# Altium project ETH_on_RS485_Node_Example.PrjPcb
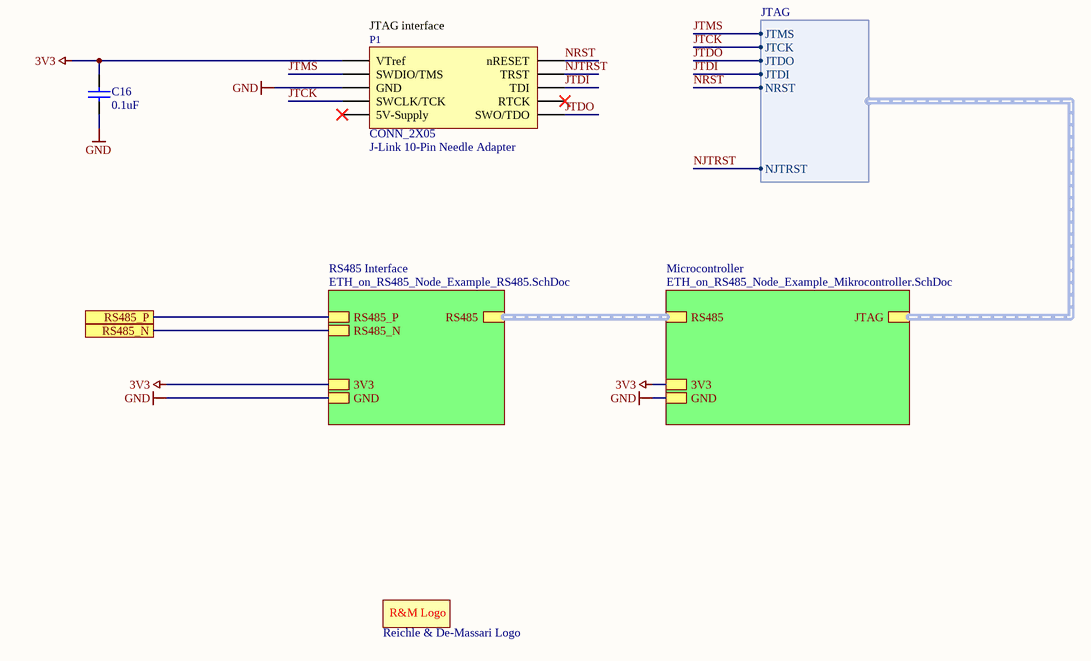
[diagram p0: ETH_on_RS485_Node_Example_TOP.SchDoc]
3 sheets, 39 parts. Net scope: strictly hierarchical (ports join the sheet entries above them; power ports are local).
Sheets:
  ETH_on_RS485_Node_Example_TOP.SchDoc
    RS485 Interface = ETH_on_RS485_Node_Example_RS485.SchDoc
    Microcontroller = ETH_on_RS485_Node_Example_Mikrocontroller.SchDoc

## Sheet ETH_on_RS485_Node_Example_TOP.SchDoc: ETH_on_RS485_Node_Example
size A3; Author: Nico Korn; CompanyName: R&M; DrawnBy: Nico Korn; Engineer: Nico Korn; Organization: Reichle & De-Massari; Address1: Binzstrasse 32; Address2: 8620 Wetzikon; Address3: Switzerland; DocumentNumber: 1; Revision: V1.0; SheetNumber: 1; SheetTotal: 7; Description1: Beschreibung; Size: A3; ShortDescription: Übersicht

### Parts
1  Reichle & De-Massari Logo  [SYMBOL_R&M]  (no BOM)
C16  0.1uF  [Ceramic Capacitor 0402 EIA]
P1  CONN_2X05  [CONN_2X05_SEGGER]  (no BOM)

### Sub-sheets
Microcontroller = ETH_on_RS485_Node_Example_Mikrocontroller.SchDoc: RS485 (harness RS485), 3V3, GND, JTAG (harness JTAG)
RS485 Interface = ETH_on_RS485_Node_Example_RS485.SchDoc: 3V3, RS485_P, RS485_N, GND, RS485 (harness RS485)

### Ports
RS485_N, RS485_P

### Harnesses
JTAG: JTMS, JTCK, JTDI, JTDO, NRST, NJTRST

### Nets
3V3: C16.2 P1.1(VTref) ; sheet RS485 Interface/3V3, sheet Microcontroller/3V3
GND: C16.1 P1.3(GND) ; sheet RS485 Interface/GND, sheet Microcontroller/GND
JTCK: P1.4(SWCLK/TCK) ; sheet Microcontroller/JTAG.JTCK
JTDI: P1.8(TDI) ; sheet Microcontroller/JTAG.JTDI
JTDO: P1.6(SWO/TDO) ; sheet Microcontroller/JTAG.JTDO
JTMS: P1.2(SWDIO/TMS) ; sheet Microcontroller/JTAG.JTMS
NJTRST: P1.9(TRST) ; sheet Microcontroller/JTAG.NJTRST
NRST: P1.10(nRESET) ; sheet Microcontroller/JTAG.NRST
RS485_1_N: port RS485_N, sheet RS485 Interface/RS485_N
RS485_1_P: port RS485_P, sheet RS485 Interface/RS485_P

Not connected (* = marked no-connect by the designer): P1 5(5V-Supply)* 7(RTCK)*

### Buses and harness runs
harness sheet Microcontroller/RS485 = sheet RS485 Interface/RS485

### Notes on the sheet
- (near P1) JTAG interface
- Title
- Size:
- Date:
- A3
- Number:
- Time:
- Revision:
- Sheet
- of
- File:
- (in symbol SYMBOL_R&M) R&M Logo

### Library data of the parts
1 = SYMBOL_R&M: Replaceable: no; Footprint/Package: 2.54mm
C16 = Cap_0.1uF_0402: SMD/SMT WCAP-CSGP 0.1uF 0402 20% 10V MLCC; Manufacturer: Wurth Electronics; Manufacturer PartNr: 885012105010; voltage: 10VDC; Dielectric Grade: X5R; Replaceable: yes; value: 0.1uF; tolerance: 20%; ComponentLink1Description: mouser; ComponentLink1URL: https://www.mouser.ch/ProductDetail/Wurth-Electronics/885012105010?qs=sGAEpiMZZMs0AnBnWHyRQEGbLOF2VP1ihL84oCjXnlO407YOHi%2fQbw%3d%3d; Footprint/Package: 0402; Supplier 1: Mouser; Supplier 2: Farnell; Supplier Part Number 1: 710-885012105010; Supplier Part Number 2: 2533928; Supplier 3: Digi-Key; Supplier Part Number 3: 732-7487-1-ND
P1 = CONN_2X05_SEGGER: J-Link 10-Pin Needle Adapter; Manufacturer: Samtec; Replaceable: no; Footprint/Package: 1.27 mm; Manufacturer PartNr: J-Link 10-Pin Needle Adapter

## Sheet ETH_on_RS485_Node_Example_RS485.SchDoc: RS485 Interface
size A3; DrawnBy: Nico Korn; Engineer: Nico Korn; Organization: Reichle & De-Massari; Address1: Binzstrasse 32; Address2: 8620 Wetzikon; Address3: Switzerland; DocumentNumber: 5; Revision: V1.0; SheetNumber: 5; SheetTotal: 7; Description1: Beschreibung; Size: A3; ShortDescription: RS485
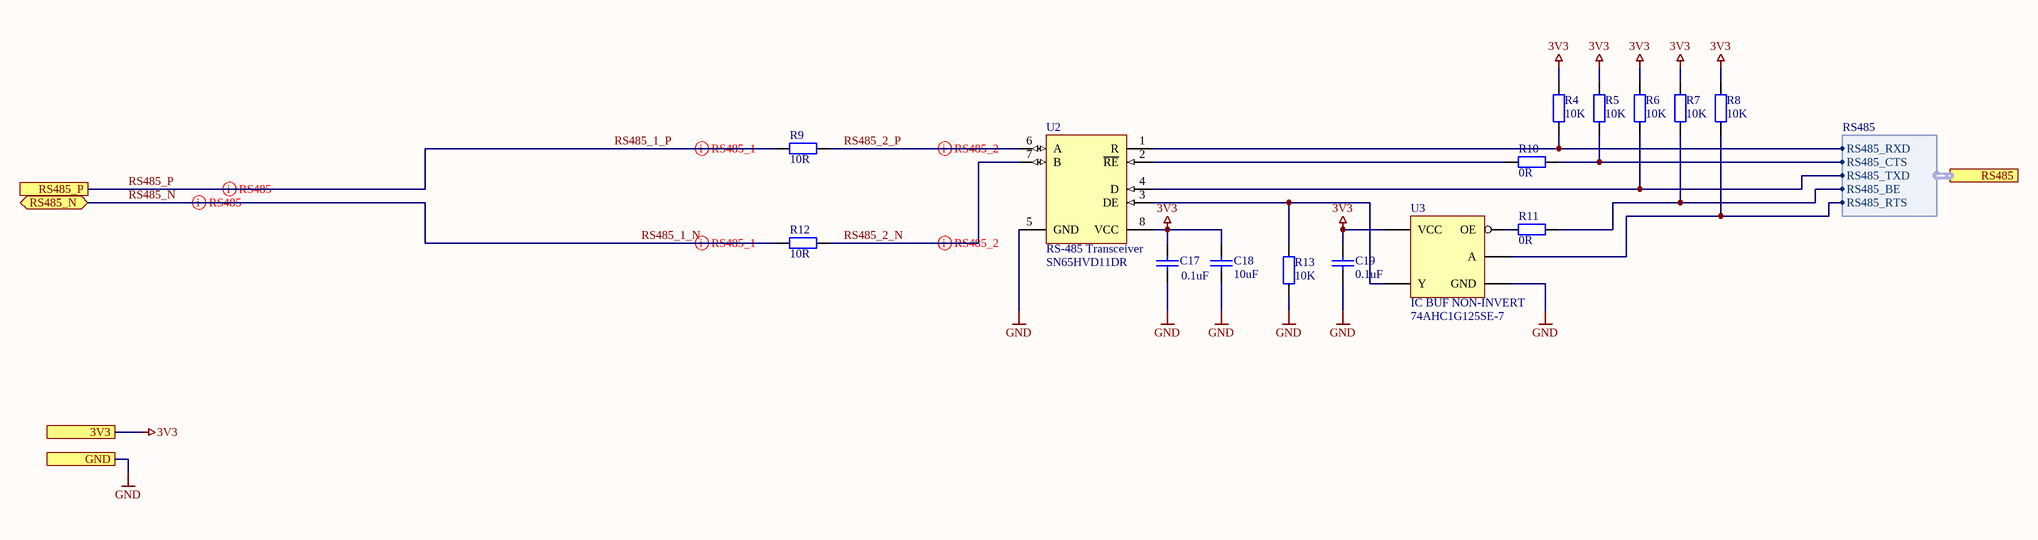
[diagram p1: ETH_on_RS485_Node_Example_RS485.SchDoc]

### Parts
C17  0.1uF  [Ceramic Capacitor 0402 EIA]
C18  10uF  [Ceramic Capacitor 0603 EIA]
C19  0.1uF  [Ceramic Capacitor 0402 EIA]
R4  10K  [Resistor 0402 EIA]
R5  10K  [Resistor 0402 EIA]
R6  10K  [Resistor 0402 EIA]
R7  10K  [Resistor 0402 EIA]
R8  10K  [Resistor 0402 EIA]
R9  10R  [Resistor 0603 EIA]
R10  0R  [Resistor 0402 EIA]
R11  0R  [Resistor 0402 EIA]
R12  10R  [Resistor 0603 EIA]
R13  10K  [Resistor 0402 EIA]
U2  RS-485 Transceiver  [TI_D (R-PDSO-G8)_8_R]
U3  IC BUF NON-INVERT  [SOT353]

### Ports
3V3, GND, RS485 (harness RS485), RS485_N (bidir), RS485_P

### Harnesses
RS485: RS485_RXD, RS485_CTS, RS485_TXD, RS485_BE, RS485_RTS

### Nets
3V3: C17.1 C18.2 C19.1 R4.2 R5.2 R6.2 R7.2 R8.2 U2.8(VCC) U3.5(VCC) ; port 3V3
GND: C17.2 C18.1 C19.2 R13.1 U2.5(GND) U3.3(GND) ; port GND
RS485_1_N: R12.1 ; port RS485_N  [also labelled RS485_N]
RS485_1_P: R9.1 ; port RS485_P  [also labelled RS485_P]
RS485_2_N: R12.2 U2.7(B)
RS485_2_P: R9.2 U2.6(A)
RS485_BE: R7.1 R11.2 ; port RS485.RS485_BE
RS485_CTS: R5.1 R10.2 ; port RS485.RS485_CTS
RS485_RTS: R8.1 U3.2(A) ; port RS485.RS485_RTS
RS485_RXD: R4.1 U2.1(R) ; port RS485.RS485_RXD
RS485_TXD: R6.1 U2.4(D) ; port RS485.RS485_TXD
NetR10_1: R10.1 U2.2(~{RE})
NetR11_1: R11.1 U3.1(OE)
NetR13_2: R13.2 U2.3(DE) U3.4(Y)

### Layout directives
differential pair: RS485_1_N, RS485_1_P, RS485_2_N, RS485_2_P

### Notes on the sheet
- Title
- Size:
- Date:
- A3
- Number:
- Time:
- Revision:
- Sheet
- of
- File:

### Library data of the parts
C17 C19 = Cap_0.1uF_0402: as C16 on sheet ETH_on_RS485_Node_Example_TOP; value: 0.1uF; tolerance: 20%; ComponentLink1Description: mouser; ComponentLink1URL: https://www.mouser.ch/ProductDetail/Wurth-Electronics/885012105010?qs=sGAEpiMZZMs0AnBnWHyRQEGbLOF2VP1ihL84oCjXnlO407YOHi%2fQbw%3d%3d; Footprint/Package: 0402; Supplier 1: Mouser; Supplier 2: Farnell; Supplier 3: Digi-Key; Supplier Part Number 1: 710-885012105010; Supplier Part Number 2: 2533928; Supplier Part Number 3: 732-7487-1-ND
C18 = Cap_10uF_0603: SMD/SMT 0603 10uF 10volts; Manufacturer: Murata; Manufacturer PartNr: GRM188D71A106MA73D; tolerance: 20%; voltage: 10VDC; Replaceable: yes; Dielectric Grade: X5R; value: 10uF; Footprint/Package: 0603
R4-R8 R13 = Res_10K_0402: SMD 10K ohm 1% 50V General Purpose; Manufacturer: Yageo; Manufacturer PartNr: RC0402FR-1010KL; power: 63mW; Replaceable: yes; value: 10K; tolerance: 1%; ComponentLink1Description: mouser; ComponentLink1URL: https://www.mouser.ch/ProductDetail/Yageo/RC0402FR-1010KL?qs=sGAEpiMZZMtlubZbdhIBIEgN9MQql2m6Sb2LnYlCICU%3d; Footprint/Package: 0402; Supplier 1: Mouser; Supplier Part Number 1: 603-RC0402FR-1010KL
R9 R12 = Res_10R_0603: SMD 0603 10ohms 1%; Manufacturer: Vishay; Manufacturer PartNr: CRCW060310R0FKEAHP; power: 250mW; Replaceable: yes; value: 10R; tolerance: 1%; Footprint/Package: 0603
R10 R11 = Res_0R_0402: 0 Ohms Resistor 0402; Manufacturer: Panasonic Electronic Components; Manufacturer PartNr: ERJ-2GE0R00X; power: 100mW; Replaceable: yes; value: 0R; tolerance: -; Footprint/Package: 0402
U2 = SN65HVD11DR: RS-485 Interface IC 3.3V Differential Transceivers; Manufacturer: Texas Instruments; Replaceable: no; Manufacturer PartNr: SN65HVD11DR; ComponentLink1Description: mouser; ComponentLink1URL: https://www.mouser.ch/ProductDetail/Texas-Instruments/SN65HVD11DR?qs=sGAEpiMZZMtk5jbcouIbS2cUqarwnJ3LOIItPoxnG4E%3d; Footprint/Package: SOIC-8; Supplier 1: Digi-Key; Supplier 2: Farnell; Supplier 3: Mouser; Supplier Part Number 1: 296-31717-6-ND; Supplier Part Number 2: 2436743; Supplier Part Number 3: 595-SN65HVD11DR
U3 = 74AHC1G125SE-7: Buffer, Non-Inverting 1 Element 1 Bit per Element 3-State Output SOT-353; Manufacturer: Diodes Incorporated; Replaceable: no; Footprint/Package: SOT353; ComponentLink1Description: mouser; ComponentLink1URL: https://www.mouser.ch/ProductDetail/Samtec/BBL-103-G-E?qs=sGAEpiMZZMs%252bGHln7q6pm5ZHNJhTjtr3eyJKd0ZImQM%3d; Supplier 2: Mouser; Supplier 1: Digi-Key; Supplier 3: Farnell; Supplier Part Number 1: SAM1104-03-ND; Supplier Part Number 2: 200-SL103G12; Supplier Part Number 3: 2019491; Manufacturer PartNr: 74AHC1G125SE-7

## Sheet ETH_on_RS485_Node_Example_Mikrocontroller.SchDoc: Microcontroller
size A3; DrawnBy: Nico Korn; Engineer: Nico Korn; Organization: Reichle & De-Massari; Address1: Binzstrasse 32; Address2: 8620 Wetzikon; Address3: Switzerland; DocumentNumber: 2; Revision: V1.0; SheetNumber: 2; SheetTotal: 7; Description1: Beschreibung; Size: A3; ShortDescription: Mikrocontroller
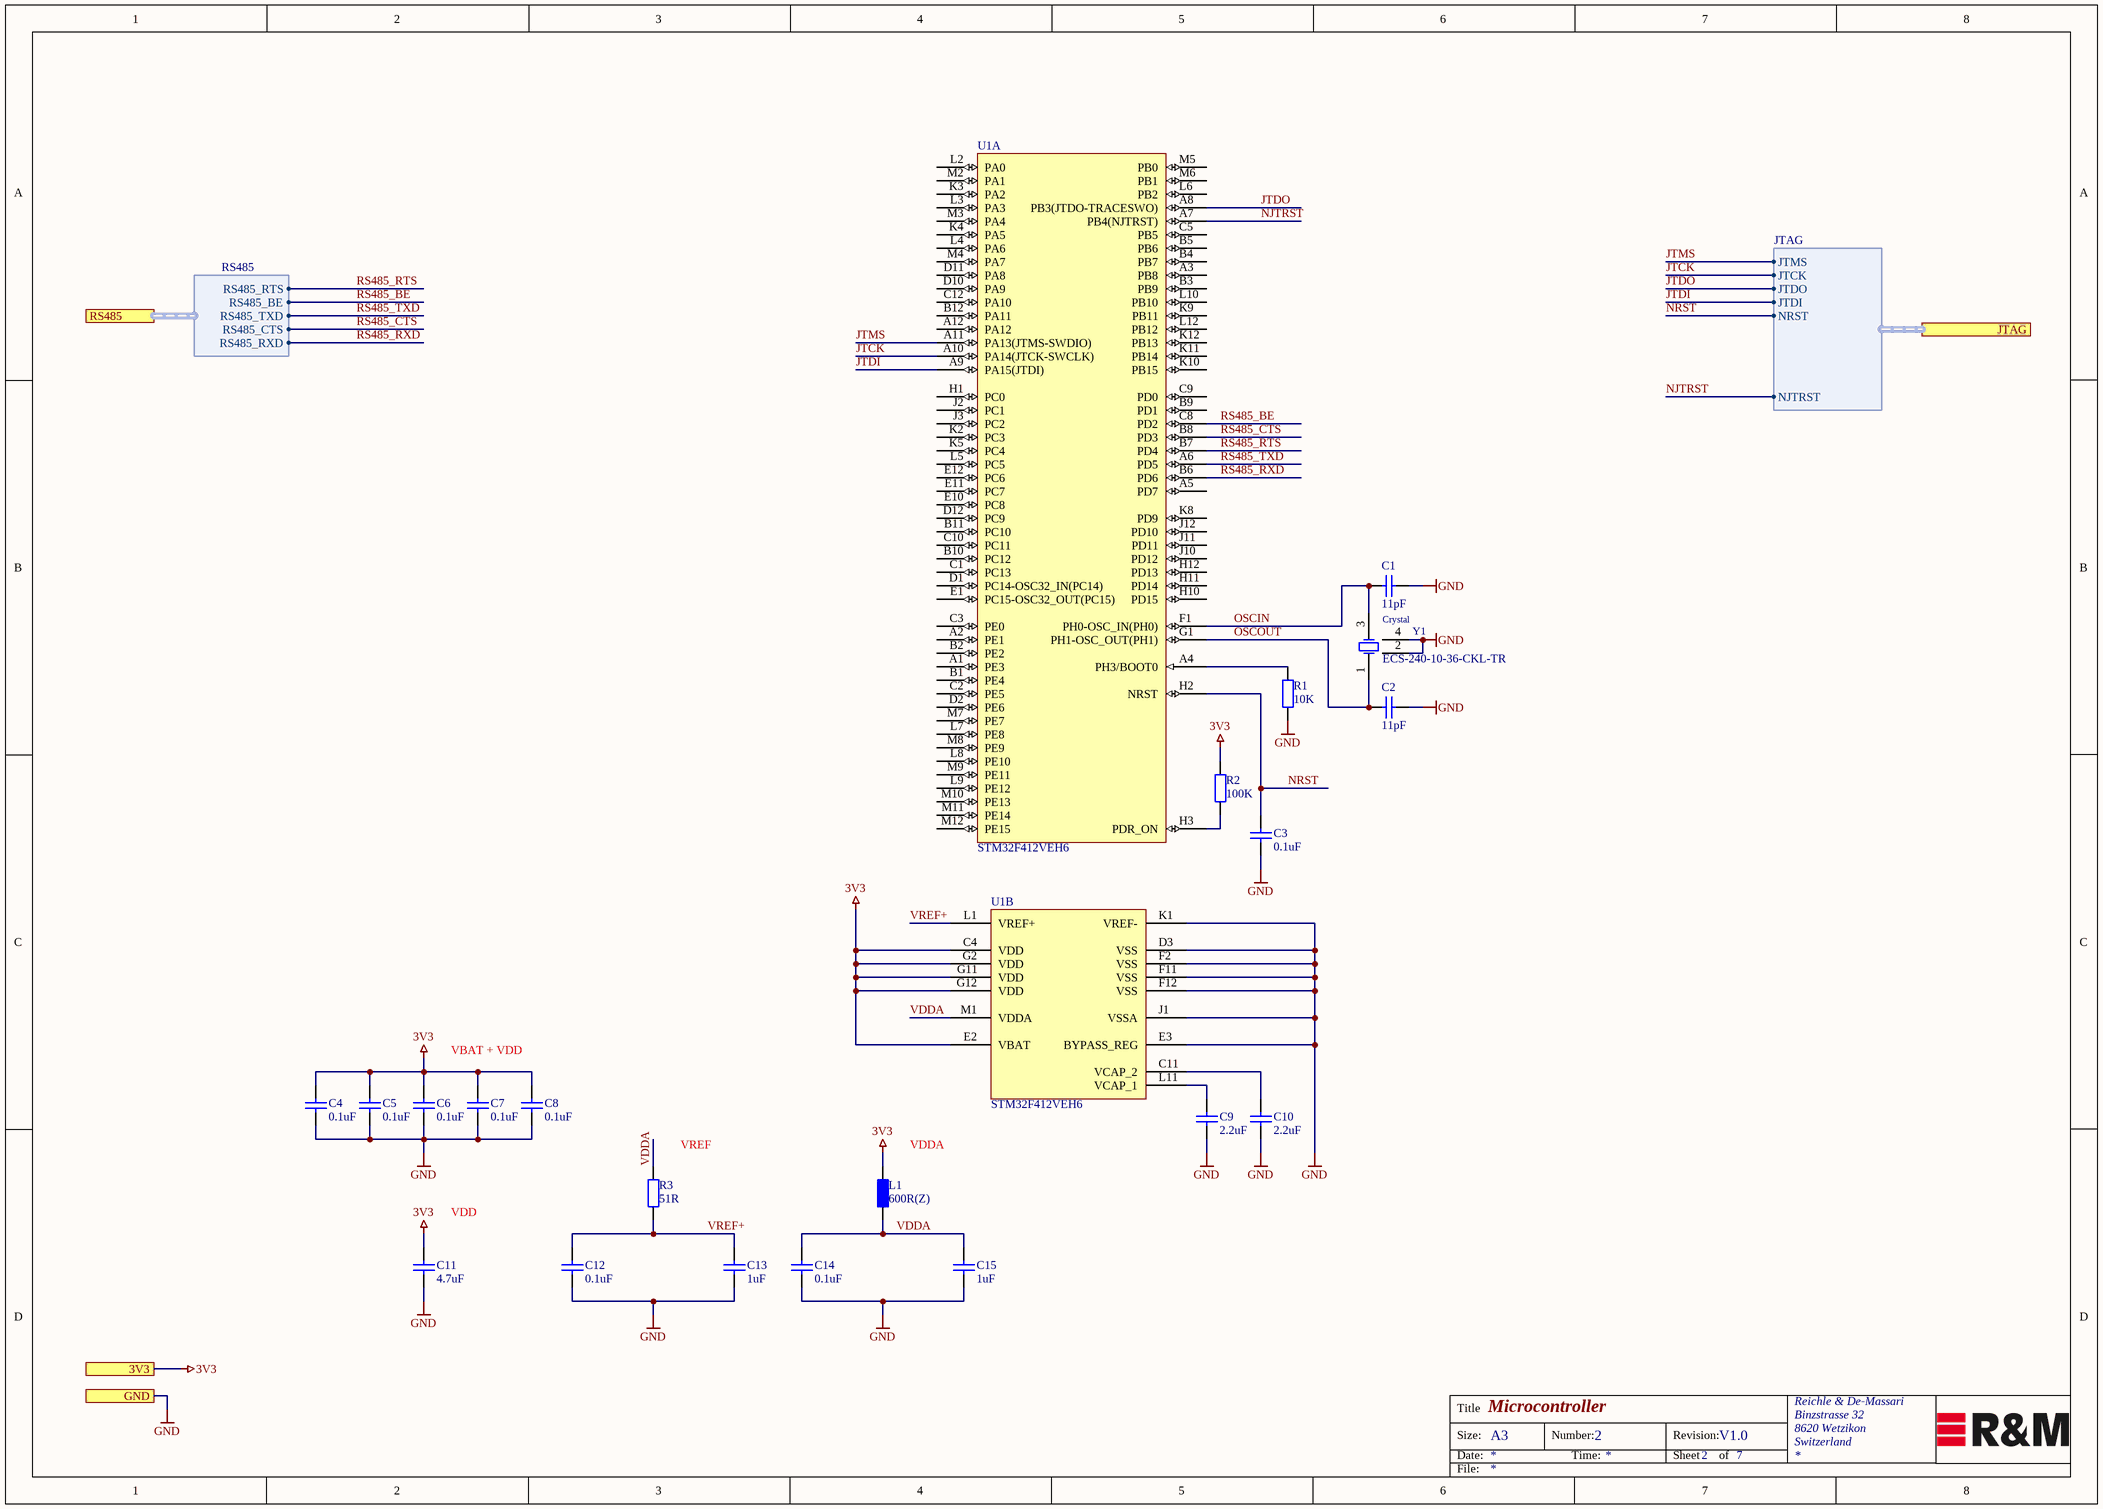
[diagram p2: ETH_on_RS485_Node_Example_Mikrocontroller.SchDoc]

### Parts
C1  11pF  [Ceramic Capacitor 0402 EIA]
C2  11pF  [Ceramic Capacitor 0402 EIA]
C3  0.1uF  [Ceramic Capacitor 0402 EIA]
C4  0.1uF  [Ceramic Capacitor 0402 EIA]
C5  0.1uF  [Ceramic Capacitor 0402 EIA]
C6  0.1uF  [Ceramic Capacitor 0402 EIA]
C7  0.1uF  [Ceramic Capacitor 0402 EIA]
C8  0.1uF  [Ceramic Capacitor 0402 EIA]
C9  2.2uF  [Ceramic Capacitor 0402 EIA]
C10  2.2uF  [Ceramic Capacitor 0402 EIA]
C11  4.7uF  [Ceramic Capacitor 0603 EIA]
C12  0.1uF  [Ceramic Capacitor 0402 EIA]
C13  1uF  [Ceramic Capacitor 0402 EIA]
C14  0.1uF  [Ceramic Capacitor 0402 EIA]
C15  1uF  [Ceramic Capacitor 0402 EIA]
L1  600R(Z)  [Inductor 0603 EIA]
R1  10K  [Resistor 0402 EIA]
R2  100K  [Resistor 0402 EIA]
R3  51R  [Resistor 0402 EIA]
U1  STM32F412VEH6  [STM_UFBGA100 7x7x0.6_100_R]  (parts A,B of 2)
Y1  Crystal  [ECS_ECX-2236_4_R]

### Ports
3V3, GND, JTAG (harness JTAG), RS485 (harness RS485)

### Harnesses
JTAG: JTMS, JTCK, JTDI, JTDO, NRST, NJTRST
RS485: RS485_RXD, RS485_CTS, RS485_TXD, RS485_BE, RS485_RTS

### Nets
3V3: C4.1 C5.1 C6.1 C7.1 C8.1 C11.2 L1.1 R2.2 U1.C4(VDD) U1.E2(VBAT) U1.G2(VDD) U1.G11(VDD) U1.G12(VDD) ; port 3V3
GND: C1.2 C2.2 C3.2 C4.2 C5.2 C6.2 C7.2 C8.2 C9.1 C10.1 C11.1 C12.1 C13.1 C14.1 C15.1 R1.1 U1.D3(VSS) U1.E3(BYPASS_REG) U1.F2(VSS) U1.F11(VSS) U1.F12(VSS) U1.J1(VSSA) U1.K1(VREF-) Y1.2(OSC2) Y1.4(OSC3) ; port GND
JTCK: U1.A10(PA14(JTCK-SWCLK)) ; port JTAG.JTCK
JTDI: U1.A9(PA15(JTDI)) ; port JTAG.JTDI
JTDO: U1.A8(PB3(JTDO-TRACESWO)) ; port JTAG.JTDO
JTMS: U1.A11(PA13(JTMS-SWDIO)) ; port JTAG.JTMS
NJTRST: U1.A7(PB4(NJTRST)) ; port JTAG.NJTRST
NRST: C3.1 U1.H2(NRST) ; port JTAG.NRST
OSCIN: C1.1 U1.F1(PH0-OSC_IN(PH0)) Y1.3(OSC2)
OSCOUT: C2.1 U1.G1(PH1-OSC_OUT(PH1)) Y1.1(OSC1)
RS485_BE: U1.C8(PD2) ; port RS485.RS485_BE
RS485_CTS: U1.B8(PD3) ; port RS485.RS485_CTS
RS485_RTS: U1.B7(PD4) ; port RS485.RS485_RTS
RS485_RXD: U1.B6(PD6) ; port RS485.RS485_RXD
RS485_TXD: U1.A6(PD5) ; port RS485.RS485_TXD
VDDA: C14.2 C15.2 L1.2 R3.2 U1.M1(VDDA)
VREF+: C12.2 C13.2 R3.1 U1.L1(VREF+)
NetC9_2: C9.2 U1.L11(VCAP_1)
NetC10_2: C10.2 U1.C11(VCAP_2)
NetR1_2: R1.2 U1.A4(PH3/BOOT0)
NetR2_1: R2.1 U1.H3(PDR_ON)

Not connected (* = marked no-connect by the designer): U1 A1(PE3) A2(PE1) A3(PB8) A5(PD7) A12(PA12) B1(PE4) B2(PE2) B3(PB9) B4(PB7) B5(PB6) B9(PD1) B10(PC12) B11(PC10) B12(PA11) C1(PC13) C2(PE5) C3(PE0) C5(PB5) C9(PD0) C10(PC11) C12(PA10) D1(PC14-OSC32_IN(PC14)) D2(PE6) D10(PA9) D11(PA8) D12(PC9) E1(PC15-OSC32_OUT(PC15)) E10(PC8) E11(PC7) E12(PC6) H1(PC0) H10(PD15) H11(PD14) H12(PD13) J2(PC1) J3(PC2) J10(PD12) J11(PD11) J12(PD10) K2(PC3) K3(PA2) K4(PA5) K5(PC4) K8(PD9) K9(PB11) K10(PB15) K11(PB14) K12(PB13) L2(PA0) L3(PA3) L4(PA6) L5(PC5) L6(PB2) L7(PE8) L8(PE10) L9(PE12) L10(PB10) L12(PB12) M2(PA1) M3(PA4) M4(PA7) M5(PB0) M6(PB1) M7(PE7) M8(PE9) M9(PE11) M10(PE13) M11(PE14) M12(PE15)

### Notes on the sheet
- VBAT + VDD
- (near R3) VREF
- (near L1) VDDA
- (near C11) VDD
- Title
- Size:
- Date:
- A3
- Number:
- Time:
- Revision:
- Sheet
- of
- File:

### Library data of the parts
C1 C2 = Cap_11pF_0402: SMD/SMT 0402 11pF 50volts C0G 5%; Manufacturer: Murata; Manufacturer PartNr: GRM1555C1H110JA01D; voltage: 50VDC; Dielectric Grade: C0G (NP0); Replaceable: yes; value: 11pF; tolerance: 5%; ComponentLink1Description: mouser; ComponentLink1URL: https://www.mouser.ch/ProductDetail/Murata-Electronics/GRM1555C1H110JA01D?qs=%2fha2pyFadug34NHqLs7eMMmZ4IY%2fB%2fBwtGmZmE%252bqlNJIuNiWKDU4cio3ILTIjZ7Z; Footprint/Package: 0402; Supplier 1: Mouser; Supplier 2: Digi-Key; Supplier 3: Farnell; Supplier Part Number 1: 81-GRM1555C1H110JA1D; Supplier Part Number 2: 490-5923-6-ND; Supplier Part Number 3: 2218837
C3-C8 C12 C14 = Cap_0.1uF_0402: as C16 on sheet ETH_on_RS485_Node_Example_TOP; tolerance: 20%; value: 0.1uF; ComponentLink1Description: mouser; ComponentLink1URL: https://www.mouser.ch/ProductDetail/Wurth-Electronics/885012105010?qs=sGAEpiMZZMs0AnBnWHyRQEGbLOF2VP1ihL84oCjXnlO407YOHi%2fQbw%3d%3d; Footprint/Package: 0402; Supplier 1: Mouser; Supplier 2: Farnell; Supplier 3: Digi-Key; Supplier Part Number 1: 710-885012105010; Supplier Part Number 2: 2533928; Supplier Part Number 3: 732-7487-1-ND
C9 C10 = Cap_2.2uF_0402: 2.2µF ±20% 25V Ceramic Capacitor X5R 0402 (1005 Metric); Manufacturer: Murata; Manufacturer PartNr: GRM155R61E225ME15D; Replaceable: yes; value: 2.2uF; tolerance: ±20%; voltage: 25V; Dielectric Grade: X5R; Footprint/Package: 0402; ComponentLink1Description: digikey; ComponentLink1URL: https://www.digikey.com/product-detail/en/murata-electronics-north-america/GRM155R61E225ME15D/490-10457-2-ND/5027542
C11 = Cap_4.7uF_0603: SMD/SMT 0603 4.7uF 10volts; Manufracturer: Murata; Manufacturer PartNr: GRM188R61A475KE15D; tolerance: 20%; voltage: 10VDC; Dielectric Grade: X5R; Replaceable: yes; value: 4.7uF; Footprint/Package: 0603
C13 C15 = Cap_1uF_0402: SMD/SMT 0402 1uF 10volts X7S 10%; Manufacturer: Murata; Manufacturer PartNr: GCM155C71A105KE38D; voltage: 10VDC; Replaceable: yes; value: 1uF; tolerance: 10%; ComponentLink1Description: mouser; ComponentLink1URL: https://www.mouser.ch/ProductDetail/Murata-Electronics/GCM155C71A105KE38D?qs=sGAEpiMZZMsh%252b1woXyUXj0FEAttKcN54ouz5zO04smg%3d; Dielectric Grade: X7S; Footprint/Package: 0402; Supplier 1: Mouser; Supplier 2: Digi-Key; Supplier Part Number 1: 81-GCM155C71A105KE8D; Supplier Part Number 2: 490-13409-6-ND
L1 = Ind_600R_0603: Ferritperlen MULTILYR CHP BD 0603 600OHMS 25%; Manufacturer: Taiyo Yuden; Manufacturer PartNr: BK1608HS601-T; Replaceable: yes; current: 350mA; value: 600R(Z); tolerance: 25%; power: *; Footprint/Package: 0603; ComponentLink1Description: mouser; ComponentLink1URL: https://www.mouser.ch/ProductDetail/Taiyo-Yuden/BK1608HS601-T?qs=sGAEpiMZZMtdyQheitOmRas3gyT7ksc5fkIjduyDg6k%3D
R1 = Res_10K_0402: as R4 on sheet ETH_on_RS485_Node_Example_RS485; value: 10K; tolerance: 1%; ComponentLink1Description: mouser; ComponentLink1URL: https://www.mouser.ch/ProductDetail/Yageo/RC0402FR-1010KL?qs=sGAEpiMZZMtlubZbdhIBIEgN9MQql2m6Sb2LnYlCICU%3d; Footprint/Package: 0402; Supplier 1: Mouser; Supplier Part Number 1: 603-RC0402FR-1010KL
R2 = Res_100K_0402: 100 kOhm Resistor 0402; Manufacturer: Vishay; Manufacturer PartNr: CRCW0402100KJNEDC; power: 63mW; Replaceable: yes; value: 100K; tolerance: -; Footprint/Package: 0402
R3 = Res_51R_0402: Resistor; Manufacturer: Yageo; Manufacturer PartNr: RC0402JR-0751RL; tolerance: 5%; power: 62.5mW; Replaceable: yes; value: 51R; Footprint/Package: 0402; ComponentLink1Description: mouser; ComponentLink1URL: https://www.mouser.ch/ProductDetail/Yageo/RC0402JR-0751RL?qs=sGAEpiMZZMtG0KNrPCHnjTtiZEI2zSDg2UFCMmEjZXQ%3d
U1 = STM_STM32F412VEH6_UFBGA100 7x7x0.6_100_1: STM32 Dynamic Efficiency MCU with BAM, High-performance and DSP with FPU, ARM Cortex-M4 MCU with 512 Kbytes Flash, 100 MHz CPU, Art Accelerator, DFSDM; Manufacturer: STM; Manufacturer PartNr: STM32F412VEH6; ShortDescription: STM32F412VEH6
Y1 = ECS-240-10-36-CKL-TR: Quarze 24MHz 10pF 10ppm -10C +70C; Manufacturer PartNr: ECS-240-10-36-CKL-TR

## Nets that join several sheets
3V3: ETH_on_RS485_Node_Example_TOP (C16.2 P1.1), ETH_on_RS485_Node_Example_RS485 (10 pins), ETH_on_RS485_Node_Example_Mikrocontroller (13 pins)
GND: ETH_on_RS485_Node_Example_TOP (C16.1 P1.3), ETH_on_RS485_Node_Example_RS485 (6 pins), ETH_on_RS485_Node_Example_Mikrocontroller (25 pins)
JTCK: ETH_on_RS485_Node_Example_TOP (P1.4), ETH_on_RS485_Node_Example_Mikrocontroller (U1.A10)
JTDI: ETH_on_RS485_Node_Example_TOP (P1.8), ETH_on_RS485_Node_Example_Mikrocontroller (U1.A9)
JTDO: ETH_on_RS485_Node_Example_TOP (P1.6), ETH_on_RS485_Node_Example_Mikrocontroller (U1.A8)
JTMS: ETH_on_RS485_Node_Example_TOP (P1.2), ETH_on_RS485_Node_Example_Mikrocontroller (U1.A11)
NJTRST: ETH_on_RS485_Node_Example_TOP (P1.9), ETH_on_RS485_Node_Example_Mikrocontroller (U1.A7)
NRST: ETH_on_RS485_Node_Example_TOP (P1.10), ETH_on_RS485_Node_Example_Mikrocontroller (C3.1 U1.H2)
RS485_BE: ETH_on_RS485_Node_Example_RS485 (R7.1 R11.2), ETH_on_RS485_Node_Example_Mikrocontroller (U1.C8)
RS485_CTS: ETH_on_RS485_Node_Example_RS485 (R5.1 R10.2), ETH_on_RS485_Node_Example_Mikrocontroller (U1.B8)
RS485_RTS: ETH_on_RS485_Node_Example_RS485 (R8.1 U3.2), ETH_on_RS485_Node_Example_Mikrocontroller (U1.B7)
RS485_RXD: ETH_on_RS485_Node_Example_RS485 (R4.1 U2.1), ETH_on_RS485_Node_Example_Mikrocontroller (U1.B6)
RS485_TXD: ETH_on_RS485_Node_Example_RS485 (R6.1 U2.4), ETH_on_RS485_Node_Example_Mikrocontroller (U1.A6)